# Altium schematic sheet INA219AID.SchDoc
size A4
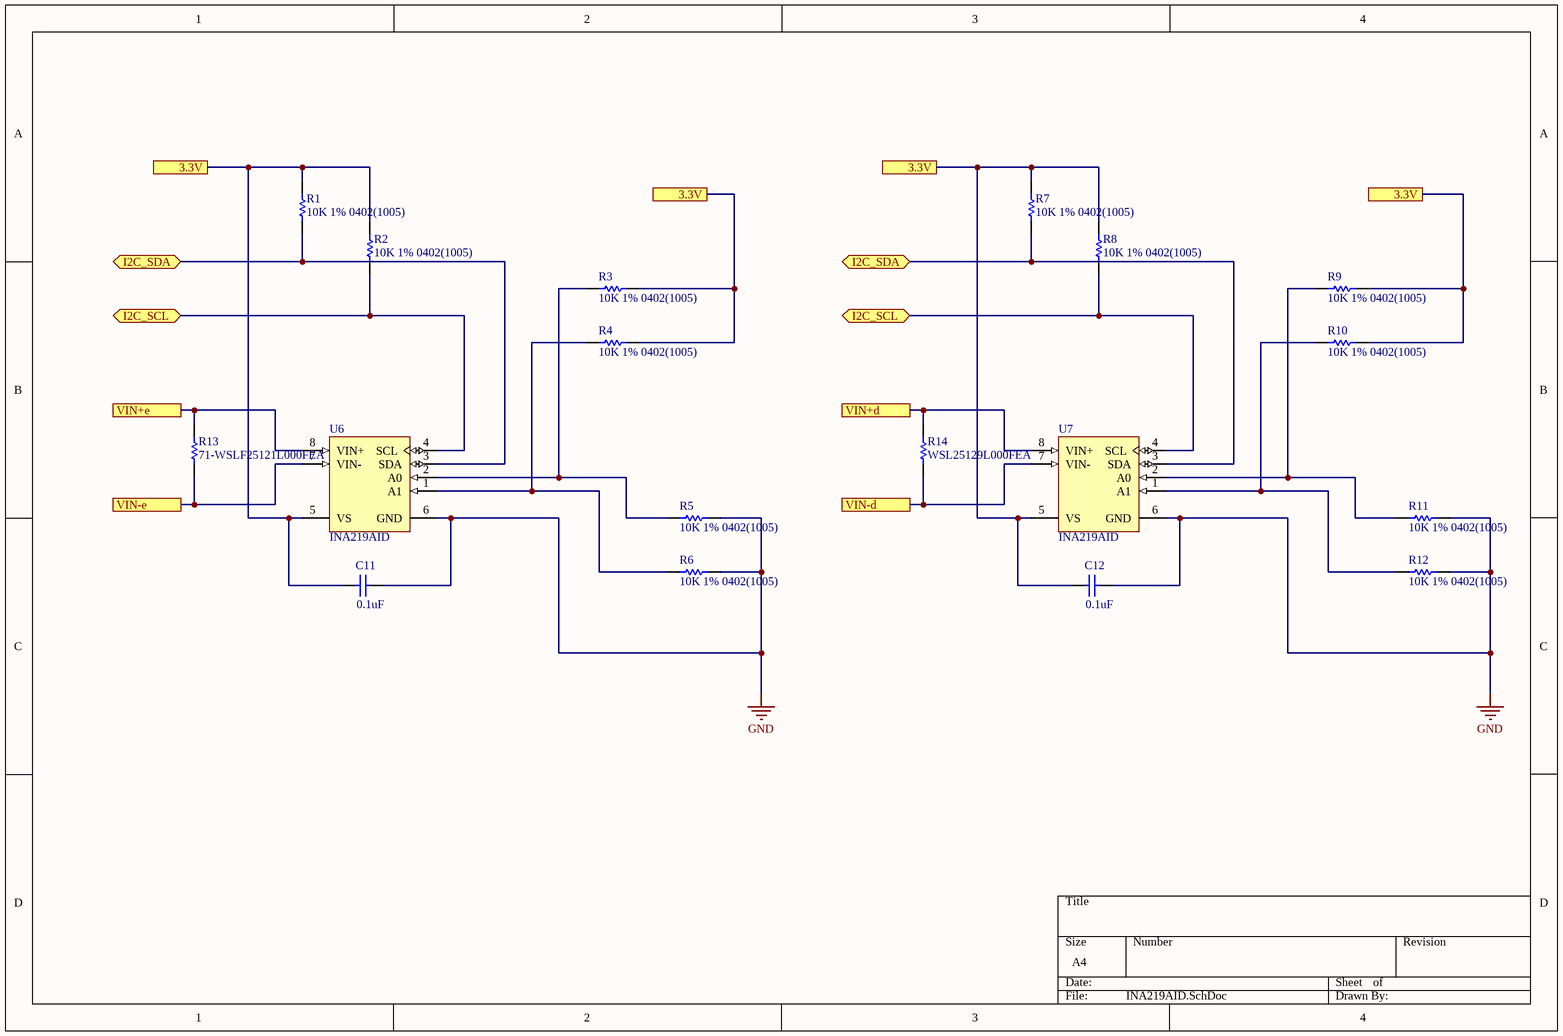
[diagram p0: INA219AID.SchDoc]

## Parts
C11  Capacitance Value: 0.1uF  [CAPC1608X90X30LL10T20]  (hidden comment: 710-885012206071)
C12  Capacitance Value: 0.1uF  [CAPC1608X90X30LL10T20]  (hidden comment: 710-885012206071)
R1  10K 1% 0402(1005)  [RESC0402(1005)_L]
R2  10K 1% 0402(1005)  [RESC0402(1005)_L]
R3  10K 1% 0402(1005)  [RESC0402(1005)_L]
R4  10K 1% 0402(1005)  [RESC0402(1005)_L]
R5  10K 1% 0402(1005)  [RESC0402(1005)_L]
R6  10K 1% 0402(1005)  [RESC0402(1005)_L]
R7  10K 1% 0402(1005)  [RESC0402(1005)_L]
R8  10K 1% 0402(1005)  [RESC0402(1005)_L]
R9  10K 1% 0402(1005)  [RESC0402(1005)_L]
R10  10K 1% 0402(1005)  [RESC0402(1005)_L]
R11  10K 1% 0402(1005)  [RESC0402(1005)_L]
R12  10K 1% 0402(1005)  [RESC0402(1005)_L]
R13  71-WSLF25121L000FEA  [RESC6432X89X76ML25T25]
R14  WSL25129L000FEA  [RESC6432X89X76ML25T25]
U6  INA219AID  [D0008A_N]
U7  INA219AID  [D0008A_N]

## Ports
3.3V, I2C_SCL (bidir), I2C_SDA (bidir), VIN+d, VIN+e, VIN-d, VIN-e

## Nets
GND: C11.2 C12.2 R5.1 R6.1 R11.2 R12.2 U6.6(GND) U7.6(GND)
3.3V: C11.1 C12.1 R1.2 R2.2 R3.1 R4.1 R7.1 R8.1 R9.2 R10.2 U6.5(VS) U7.5(VS) ; port 3.3V
I2C_SCL: R2.1 R8.2 U6.4(SCL) U7.4(SCL) ; port I2C_SCL
I2C_SDA: R1.1 R7.2 U6.3(SDA) U7.3(SDA) ; port I2C_SDA
VIN+d: R14.2 U7.8(VIN+) ; port VIN+d
VIN+e: R13.2 U6.8(VIN+) ; port VIN+e
VIN-d: R14.1 U7.7(VIN-) ; port VIN-d
VIN-e: R13.1 U6.7(VIN-) ; port VIN-e
NetR3_2: R3.2 R5.2 U6.2(A0)
NetR4_2: R4.2 R6.2 U6.1(A1)
NetR9_1: R9.1 R11.1 U7.2(A0)
NetR10_1: R10.1 R12.1 U7.1(A1)

## Library data of the parts
C11 = CMP-2000-06092-1: Chip Capacitor, 100 nF, +/- 10%, 50 V, -55 to 125 degC, 0603 (1608 Metric), RoHS, Tape and Reel                710-885012206071; Manufacturer: SamsungElectro-Mechanics; Product Length: 1.6mm; Voltage: 25Vdc; Product Height: 0.8mm; Rad Hard: No; Dielectric: X7R; Packaging: Tape&Reel; Package Description: 2-Pin Surface Mount Device, Body 1.60 x 0.80 mm; Package Reference: 0603; Datasheet Version: 06/2016; Operating Temperature: -55to125°C; Category: CapacitorCeramicMultilayer; Product Depth: 0.8mm; Mounting Technology: SurfaceMount; Package/Case: 0603; Tolerance: 10%; Construction: Flat; Mounting: SurfaceMount; Datasheet URL: https://br.mouser.com/datasheet/2/445/885012206071-554587.pdf
C12 = CMP-2000-06092-1: Chip Capacitor, 100 nF, +/- 10%, 50 V, -55 to 125 degC, 0603 (1608 Metric), RoHS, Tape and Reel               710-885012206071; Manufacturer: SamsungElectro-Mechanics; Product Length: 1.6mm; Voltage: 25Vdc; Product Height: 0.8mm; Rad Hard: No; Dielectric: X7R; Packaging: Tape&Reel; Package Description: 2-Pin Surface Mount Device, Body 1.60 x 0.80 mm; Package Reference: 0603; Datasheet Version: 06/2016; Operating Temperature: -55to125°C; Category: CapacitorCeramicMultilayer; Product Depth: 0.8mm; Mounting Technology: SurfaceMount; Package/Case: 0603; Tolerance: 10%; Construction: Flat; Mounting: SurfaceMount; Datasheet URL: https://br.mouser.com/datasheet/2/445/885012206071-554587.pdf
R1 = CMP-1011-00623-1: 10K 0.063W 1% 0402 (1005 Metric)  SMD                                   71-CRCW040210K0FKEDC; Case-Metric: 1005; Value: 10000.00 Ohm; Case-EIA: 0402; Tolerance: 1 %; Technology: SMT; Power: 0.063 W
R2 = CMP-1011-00623-1: 10K 0.063W 1% 0402 (1005 Metric)  SMD                             71-CRCW040210K0FKEDC; Case-Metric: 1005; Value: 10000.00 Ohm; Case-EIA: 0402; Tolerance: 1 %; Technology: SMT; Power: 0.063 W
R3 = CMP-1011-00623-1: 10K 0.063W 1% 0402 (1005 Metric)  SMD                              71-CRCW040210K0FKEDC; Case-Metric: 1005; Value: 10000.00 Ohm; Case-EIA: 0402; Tolerance: 1 %; Technology: SMT; Power: 0.063 W
R4 = CMP-1011-00623-1: 10K 0.063W 1% 0402 (1005 Metric)  SMD                               71-CRCW040210K0FKEDC; Case-Metric: 1005; Value: 10000.00 Ohm; Case-EIA: 0402; Tolerance: 1 %; Technology: SMT; Power: 0.063 W
R5 = CMP-1011-00623-1: 10K 0.063W 1% 0402 (1005 Metric)  SMD                                 71-CRCW040210K0FKEDC; Case-Metric: 1005; Value: 10000.00 Ohm; Case-EIA: 0402; Tolerance: 1 %; Technology: SMT; Power: 0.063 W
R6 R12 = CMP-1011-00623-1: 10K 0.063W 1% 0402 (1005 Metric)  SMD                                      71-CRCW040210K0FKEDC; Case-Metric: 1005; Value: 10000.00 Ohm; Case-EIA: 0402; Tolerance: 1 %; Technology: SMT; Power: 0.063 W
R7 = CMP-1011-00623-1: 10K 0.063W 1% 0402 (1005 Metric)  SMD                                     71-CRCW040210K0FKEDC; Case-Metric: 1005; Value: 10000.00 Ohm; Case-EIA: 0402; Tolerance: 1 %; Technology: SMT; Power: 0.063 W
R8 = CMP-1011-00623-1: 10K 0.063W 1% 0402 (1005 Metric)  SMD                                    71-CRCW040210K0FKEDC; Case-Metric: 1005; Value: 10000.00 Ohm; Case-EIA: 0402; Tolerance: 1 %; Technology: SMT; Power: 0.063 W
R9 = CMP-1011-00623-1: 10K 0.063W 1% 0402 (1005 Metric)  SMD                                       71-CRCW040210K0FKEDC; Case-Metric: 1005; Value: 10000.00 Ohm; Case-EIA: 0402; Tolerance: 1 %; Technology: SMT; Power: 0.063 W
R10 = CMP-1011-00623-1: 10K 0.063W 1% 0402 (1005 Metric)  SMD                                71-CRCW040210K0FKEDC; Case-Metric: 1005; Value: 10000.00 Ohm; Case-EIA: 0402; Tolerance: 1 %; Technology: SMT; Power: 0.063 W
R11 = CMP-1011-00623-1: 10K 0.063W 1% 0402 (1005 Metric)  SMD                                  71-CRCW040210K0FKEDC; Case-Metric: 1005; Value: 10000.00 Ohm; Case-EIA: 0402; Tolerance: 1 %; Technology: SMT; Power: 0.063 W
R13 = CMP-2000-07419-1: Chip Resistor, 9 mOhm, +/- 1%, 1 W, -65 to 170 degC, 2512 (6432 Metric), RoHS, Tape and Reel                        71-WSLF25121L000FEA; Manufacturer: Vishay; Case Height: 0.635mm; Resistance: 0.009Ohms; Case Width: 3.2mm; Case Length: 6.4mm; Brand: Vishay/Dale; Power Rating: 6W; Temperature Coefficient: 75PPM/C; Series: WSL; Package / Case: 2512(6432metric); Package Reference: 2512; Type: PowerMetalStripResistors,LowValue(downto0.0005Ohms),SurfaceMount; Termination Style: SMD/SMT; Case Code - mm: 6432; Case Code - in: 2512; Factory Pack Quantity: 2000; Operating Temperature Range: -65Cto+170C; Tolerance: 1%; Packaging: Reel; Datasheet URL: http://www.vishay.com/docs/30100/wsl.pdf; Package Description: 2-Pin Surface Mount Device, Body 6.35 x 3.18 mm; Manufacturer URL: http://www.vishay.com/; Datasheet Version: 07/2016; RoHS: Details; Product: MetalElementCurrentSensingResistors; Mounting Technology: SurfaceMount; Product Category: CurrentSenseResistors-SMD
R14 = CMP-2000-07419-1: Chip Resistor, 9 mOhm, +/- 1%, 1 W, -65 to 170 degC, 2512 (6432 Metric), RoHS, Tape and Reel                       71-WSLF25121L000FEA; Manufacturer: Vishay; Case Height: 0.635mm; Resistance: 0.009Ohms; Case Width: 3.2mm; Case Length: 6.4mm; Brand: Vishay/Dale; Power Rating: 6W; Temperature Coefficient: 75PPM/C; Series: WSL; Package / Case: 2512(6432metric); Package Reference: 2512; Type: PowerMetalStripResistors,LowValue(downto0.0005Ohms),SurfaceMount; Termination Style: SMD/SMT; Case Code - mm: 6432; Case Code - in: 2512; Factory Pack Quantity: 2000; Operating Temperature Range: -65Cto+170C; Tolerance: 1%; Packaging: Reel; Datasheet URL: http://www.vishay.com/docs/30100/wsl.pdf; Package Description: 2-Pin Surface Mount Device, Body 6.35 x 3.18 mm; Manufacturer URL: http://www.vishay.com/; Datasheet Version: 07/2016; RoHS: Details; Product: MetalElementCurrentSensingResistors; Mounting Technology: SurfaceMount; Product Category: CurrentSenseResistors-SMD
U6 U7 = CMP-0704-00006-2: Zero-Drift, Bi-Directional Current / Power Monitor, 3 to 5.5 V, -40 to 125 degC, 8-pin SOIC (D8), Green (RoHS & no Sb/Br); Manufacturer: Texas Instruments; Vs(Max)(V): 5.5; Rating: Catalog; Gain(V/V): 1, 0.5, 0.25, 0.125; Vs(Min)(V): 3; Common Mode Range(Max)(V): 26; Input Offset (+/-)(Max)(uV): 100; Small-Signal Bandwidth(Typ)(MHz): 0.011; SubFamily: Current Shunt Monitor; Common Mode Range(Min)(V): 0; Quiescent Current (+/-)(Typ)(mA): 0.7; PartNumber: INA219AID; ComponentLink2Description: Datasheet; PackageVersion: 4040047-3/M, 06/2011; ComponentLink3Description: Package Specification; Mounting Technology: Surface Mount; ComponentLink2URL: http://www.ti.com/general/docs/lit/getliterature.tsp?genericPartNumber=INA219&fileType=pdf; Eco-Plan: Green (RoHS & no Sb/Br); DatasheetVersion: SBOS448F; Code_JEDEC: MS-012; PackageDescription: 8-Pin Plastic Small Outline, Body 4.9 x 3.9 mm, Pitch 1.27 mm; ComponentLink1Description: Manufacturer URL; ComponentLink1URL: http://www.ti.com/; PackageReference: D0008A; ComponentLink3URL: http://www.ti.com/lit/ml/msoi002j/msoi002j.pdf; CMRR(Min)(dB): 100